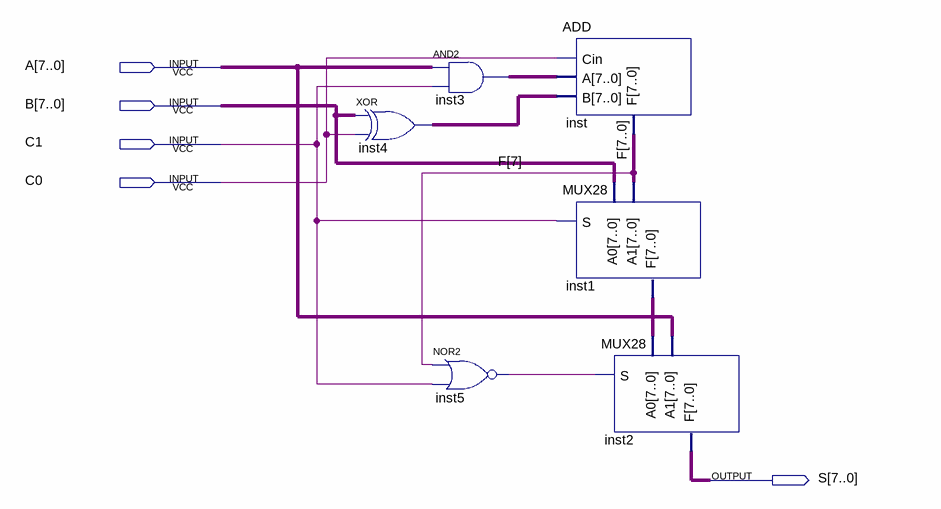
[diagram p0: schematic sheet]
// Quartus schematic ADD_SUB_MAX.bdf as structural Verilog: 6 symbols, 5 pins
module ADD_SUB_MAX (
  input  [7:0] A,
  input  [7:0] B,
  input  C1,
  input  C0,
  output [7:0] S
);

  wire inst5_out;
  wire [7:0] F, inst1_f, inst3_out, inst4_out;

  assign inst4_out = B ^ {8{C0}};  // XOR inst4, 8 bits wide
  assign inst3_out = A & {8{C1}};  // AND2 inst3, 8 bits wide
  nor inst5 (inst5_out, F[7], C1);
  ADD inst (.Cin(C0), .A(inst3_out), .B(inst4_out), .F(F));
  MUX28 inst1 (.S(C1), .A0(B), .A1(F), .F(inst1_f));
  MUX28 inst2 (.S(inst5_out), .A0(inst1_f), .A1(A), .F(S));
endmodule
